# Altium project IMU_PCB2_Project.PrjPcb
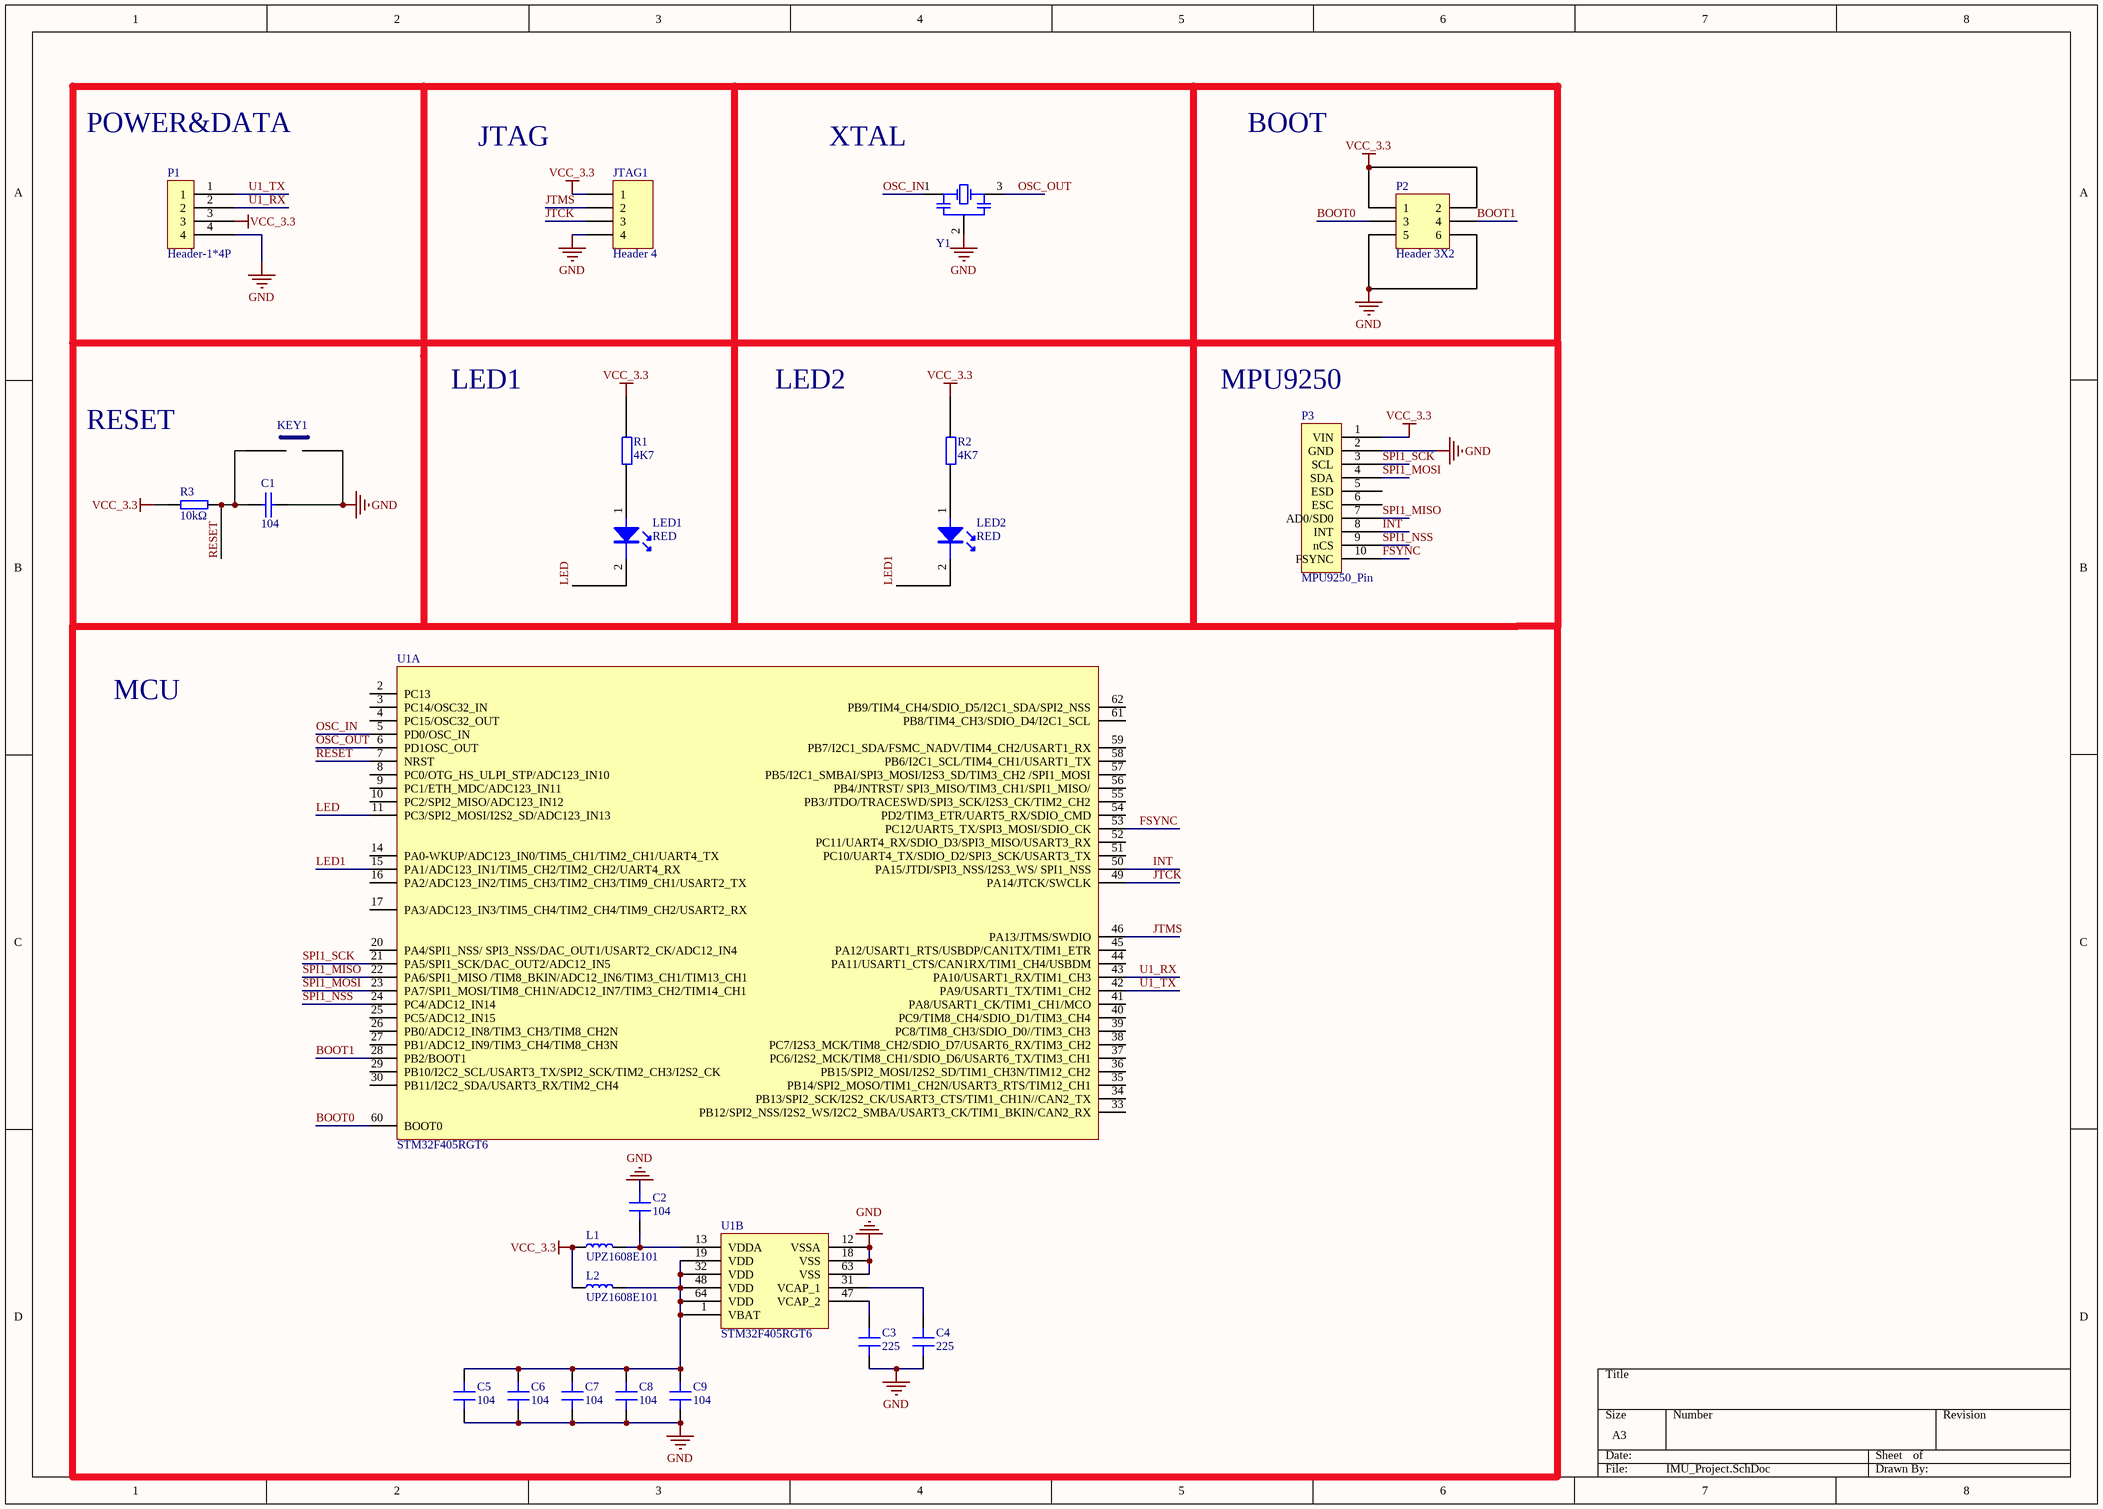
[diagram p0: IMU_Project.SchDoc]
1 sheet, 23 parts. Net scope: global (net labels, ports and power ports of the same name join across sheets).
Board file: IMU_Project2.PcbDoc

## Sheet IMU_Project.SchDoc
size A3

### Parts
C1  104  [C0603]
C2  104  [C0603/1608]
C3  225  [C0603/1608]
C4  225  [C0603/1608]
C5  104  [C0603/1608]
C6  104  [C0603/1608]
C7  104  [C0603/1608]
C8  104  [C0603/1608]
C9  104  [C0603/1608]
JTAG1  Header 4  [Header1*4_XH2.54_zhi]
KEY1  KEY2  [KEY_RESET]  (value not drawn)
L1  UPZ1608E101  [L0603/1608]
L2  UPZ1608E101  [L0603/1608]
LED1  Color: RED  [LED0603]  (hidden comment: LED RED)
LED2  Color: RED  [LED0603]  (hidden comment: LED RED)
P1  Header-1*4P  [Header1*4_XH2.54_Lie]
P2  Header 3X2  [BOOT]
P3  MPU9250_Pin  [MPU9250_Pin]
R1  4K7  [R0603]
R2  4K7  [R0603]
R3  10kΩ  [R0603]
U1  STM32F405RGT6  [LQFP64]  (parts A,B of 2)
Y1  Crystal_Cap  [XTAL-3213]  (value not drawn)

### Nets
GND: C1.2 C2.2 C3.1 C4.1 C5.1 C6.1 C7.1 C8.1 C9.1 JTAG1.4 KEY1.1 P1.4 P2.5 P2.6 P3.2(GND) U1.12(VSSA) U1.18(VSS) U1.63(VSS) Y1.2(OSC2)
VCC_3.3: JTAG1.1 L1.1 L2.1 P1.3 P2.1 P2.2 P3.1(VIN) R1.2 R2.2 R3.2
BOOT0: P2.3 U1.60(BOOT0)
BOOT1: P2.4 U1.28(PB2/BOOT1)
FSYNC: P3.10(FSYNC) U1.53(PC12/UART5_TX/SPI3_MOSI/SDIO_CK)
INT: P3.8(INT) U1.50(PA15/JTDI/SPI3_NSS/I2S3_WS/_SPI1_NSS)
JTCK: JTAG1.3 U1.49(PA14/JTCK/SWCLK)
JTMS: JTAG1.2 U1.46(PA13/JTMS/SWDIO)
LED: LED1.2(K) U1.11(PC3/SPI2_MOSI/I2S2_SD/ADC123_IN13)
LED1: LED2.2(K) U1.15(PA1/ADC123_IN1/TIM5_CH2/TIM2_CH2/UART4_RX)
OSC_IN: U1.5(PD0/OSC_IN) Y1.1(OSC1)
OSC_OUT: U1.6(PD1OSC_OUT) Y1.3(OSC3)
RESET: C1.1 KEY1.2 R3.1 U1.7(NRST)
SPI1_MISO: P3.7(AD0/SD0) U1.22(PA6/SPI1_MISO_/TIM8_BKIN/ADC12_IN6/TIM3_CH1/TIM13_CH1)
SPI1_MOSI: P3.4(SDA) U1.23(PA7/SPI1_MOSI/TIM8_CH1N/ADC12_IN7/TIM3_CH2/TIM14_CH1)
SPI1_NSS: P3.9(nCS) U1.24(PC4/ADC12_IN14)
SPI1_SCK: P3.3(SCL) U1.21(PA5/SPI1_SCK/DAC_OUT2/ADC12_IN5)
U1_RX: P1.2 U1.43(PA10/USART1_RX/TIM1_CH3)
U1_TX: P1.1 U1.42(PA9/USART1_TX/TIM1_CH2)
NetC2_1: C2.1 L1.2 U1.13(VDDA)
NetC3_2: C3.2 U1.47(VCAP_2)
NetC4_2: C4.2 U1.31(VCAP_1)
NetC5_2: C5.2 C6.2 C7.2 C8.2 C9.2 L2.2 U1.1(VBAT) U1.19(VDD) U1.32(VDD) U1.48(VDD) U1.64(VDD)
NetLED1_1: LED1.1(A) R1.1
NetLED2_1: LED2.1(A) R2.1

Not connected (* = marked no-connect by the designer): P3 5(ESD) 6(ESC); U1 2(PC13) 3(PC14/OSC32_IN) 4(PC15/OSC32_OUT) 8(PC0/OTG_HS_ULPI_STP/ADC123_IN10) 9(PC1/ETH_MDC/ADC123_IN11) 10(PC2/SPI2_MISO/ADC123_IN12) 14(PA0-WKUP/ADC123_IN0/TIM5_CH1/TIM2_CH1/UART4_TX) 16(PA2/ADC123_IN2/TIM5_CH3/TIM2_CH3/TIM9_CH1/USART2_TX) 17(PA3/ADC123_IN3/TIM5_CH4/TIM2_CH4/TIM9_CH2/USART2_RX) 20(PA4/SPI1_NSS/_SPI3_NSS/DAC_OUT1/USART2_CK/ADC12_IN4) 25(PC5/ADC12_IN15) 26(PB0/ADC12_IN8/TIM3_CH3/TIM8_CH2N) 27(PB1/ADC12_IN9/TIM3_CH4/TIM8_CH3N) 29(PB10/I2C2_SCL/USART3_TX/SPI2_SCK/TIM2_CH3/I2S2_CK) 30(PB11/I2C2_SDA/USART3_RX/TIM2_CH4) 33(PB12/SPI2_NSS/I2S2_WS/I2C2_SMBA/USART3_CK/TIM1_BKIN/CAN2_RX) 34(PB13/SPI2_SCK/I2S2_CK/USART3_CTS/TIM1_CH1N//CAN2_TX) 35(PB14/SPI2_MOSO/TIM1_CH2N/USART3_RTS/TIM12_CH1) 36(PB15/SPI2_MOSI/I2S2_SD/TIM1_CH3N/TIM12_CH2) 37(PC6/I2S2_MCK/TIM8_CH1/SDIO_D6/USART6_TX/TIM3_CH1) 38(PC7/I2S3_MCK/TIM8_CH2/SDIO_D7/USART6_RX/TIM3_CH2) 39(PC8/TIM8_CH3/SDIO_D0//TIM3_CH3) 40(PC9/TIM8_CH4/SDIO_D1/TIM3_CH4) 41(PA8/USART1_CK/TIM1_CH1/MCO) 44(PA11/USART1_CTS/CAN1RX/TIM1_CH4/USBDM) 45(PA12/USART1_RTS/USBDP/CAN1TX/TIM1_ETR) 51(PC10/UART4_TX/SDIO_D2/SPI3_SCK/USART3_TX) 52(PC11/UART4_RX/SDIO_D3/SPI3_MISO/USART3_RX) 54(PD2/TIM3_ETR/UART5_RX/SDIO_CMD) 55(PB3/JTDO/TRACESWD/SPI3_SCK/I2S3_CK/TIM2_CH2) 56(PB4/JNTRST/_SPI3_MISO/TIM3_CH1/SPI1_MISO/) 57(PB5/I2C1_SMBAI/SPI3_MOSI/I2S3_SD/TIM3_CH2_/SPI1_MOSI) 58(PB6/I2C1_SCL/TIM4_CH1/USART1_TX) 59(PB7/I2C1_SDA/FSMC_NADV/TIM4_CH2/USART1_RX) 61(PB8/TIM4_CH3/SDIO_D4/I2C1_SCL) 62(PB9/TIM4_CH4/SDIO_D5/I2C1_SDA/SPI2_NSS)

### Notes on the sheet
- POWER&DATA
- JTAG
- XTAL
- BOOT
- RESET
- LED1
- LED2
- (near P3) MPU9250
- MCU

### Library data of the parts
C1 = CAP_WYN
C2-C9 = 陶瓷电容
JTAG1 = Header 4: Header, 4-Pin; LatestRevisionDate: 17-Jul-2002; LatestRevisionNote: Re-released for DXP Platform.; Publisher: Altium Limited
KEY1 = KEY
L1 L2 = 磁珠: 贴片磁珠
LED1 LED2 = LED
P1 = Header-1*4P: 单排4P排针
P2 = Header 3X2: Header, 3-Pin, Dual row; LatestRevisionDate: 17-Jul-2002; LatestRevisionNote: Re-released for DXP Platform.; Publisher: Altium Limited
R1 R2 = Resistor
R3 = RES_WYN
U1 = STM32F405RGT6: 微控制器STM32F405RGT6
Y1 = Crystal_Cap: Published: 8-Jun-2000; LatestRevisionDate: 17-Jul-2002; LatestRevisionNote: Re-released for DXP Platform.; Publisher: Altium Limited